# EAGLE design ESP32-S3 Parallel TFT with Touch 4.0“ ST7701 v1.2 (EAGLE 6.1)
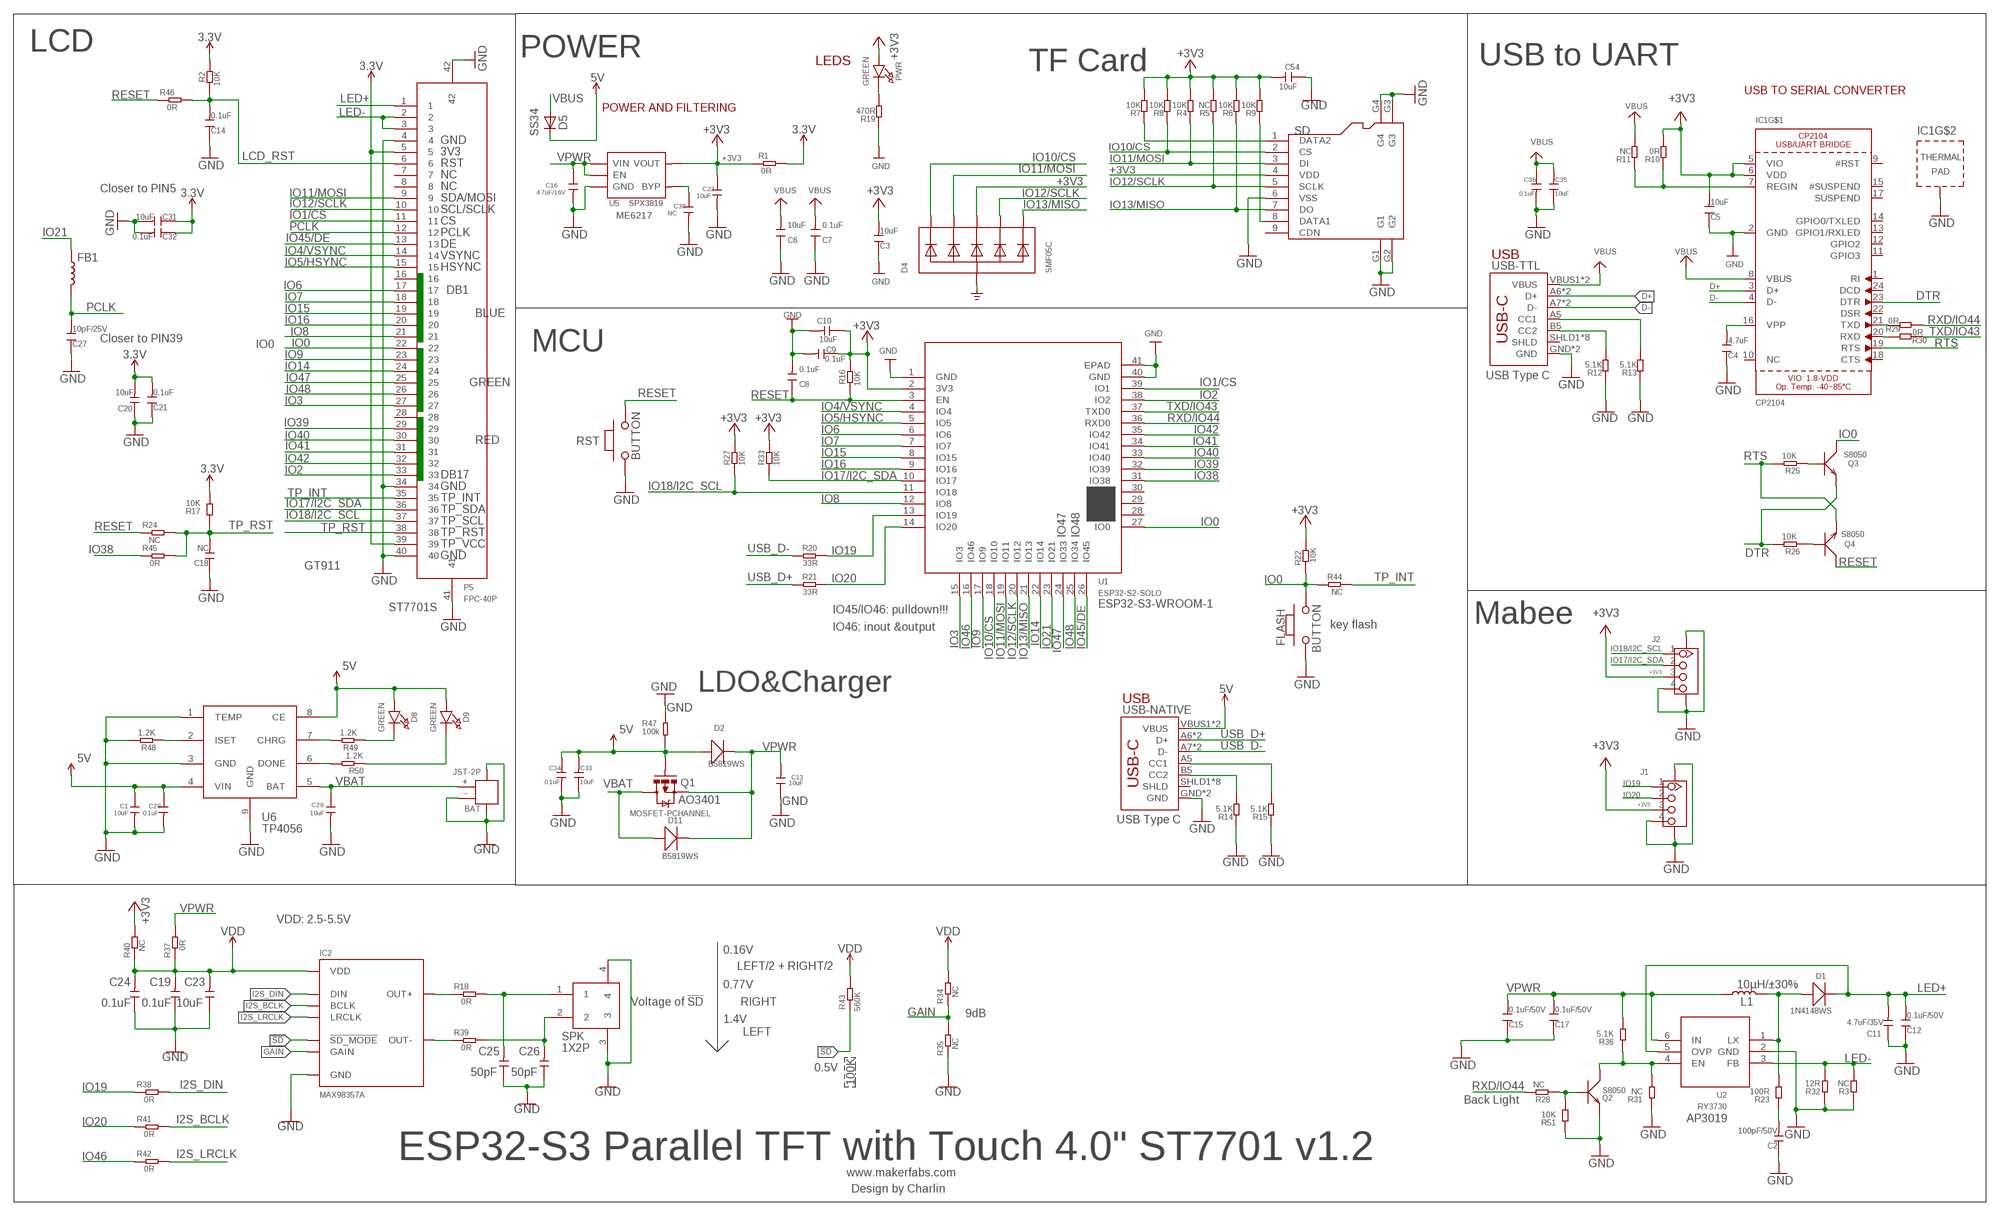
[diagram p0: schematic, sheet 1]

## Parts
BAT  JST-2P  JST-2P-SMD'2.0'  [HW2-SMD-2.0-90D]
C1  10uF  C-0603  [0603]
C2  100pF/50V  DISCRETE_C-0603  [DISCRETE_C0603]
C3  10uF  DISCRETE_C-0603  [DISCRETE_C0603]
C4  4.7uF  DISCRETE_C-0603  [DISCRETE_C0603]
C5  10uF  DISCRETE_C-0603  [DISCRETE_C0603]
C6  10uF  DISCRETE_C-0603  [DISCRETE_C0603]
C7  0.1uF  DISCRETE_C-0603  [DISCRETE_C0603]
C8  0.1uF  DISCRETE_C-0603  [DISCRETE_C0603]
C9  0.1uF  DISCRETE_C-0603  [DISCRETE_C0603]
C10  10uF  DISCRETE_C-0603  [DISCRETE_C0603]
C11  4.7uF/35V  DISCRETE_C-1206  [DISCRETE_C1206]
C12  0.1uF/50V  DISCRETE_C-0603  [DISCRETE_C0603]
C13  10uF  C-0603  [0603]
C14  0.1uF  DISCRETE_C-0603  [DISCRETE_C0603]
C15  0.1uF/50V  DISCRETE_C-0603  [DISCRETE_C0603]
C16  4.7uF/16V  C-0603  [0603]
C17  0.1uF/50V  DISCRETE_C-0603  [DISCRETE_C0603]
C18  NC  DISCRETE_C-0603  [DISCRETE_C0603]
C19  0.1uF  C-0603  [0603]
C20  10uF  DISCRETE_C-0603  [DISCRETE_C0603]
C21  0.1uF  DISCRETE_C-0603  [DISCRETE_C0603]
C22  10uF  C-0603  [0603]
C23  10uF  C-0603  [0603]
C24  0.1uF  C-0603  [0603]
C25  50pF  C-0603  [0603]
C26  50pF  C-0603  [0603]
C27  10pF/25V  DISCRETE_C-0603  [DISCRETE_C0603]
C28  0.1uF  C-0603  [0603]
C29  10uF  C-0603  [0603]
C30  NC  C-0603  [0603]
C31  10uF  DISCRETE_C-0603  [DISCRETE_C0603]
C32  0.1uF  DISCRETE_C-0603  [DISCRETE_C0603]
C33  10uF  C-0603  [0603]
C34  0.1uF  C-0603  [0603]
C35  10uF  C-0603  [0603]
C36  0.1uF  C-0603  [0603]
C54  10uF  DISCRETE_C-0603  [DISCRETE_C0603]
D1  1N4148WS  D'0805'  [SOD323]
D2  B5819WS  D'0805'  [SOD323]
D4  SMF05C  TVSARRAY_5LANE  [SOT363]
D5  SS34  DIODE-DO-214AC  [DO-214AC]
D8  GREEN  LED0805_NOOUTLINE  [CHIPLED_0805_NOOUTLINE]
D9  GREEN  LED0805_NOOUTLINE  [CHIPLED_0805_NOOUTLINE]
D11  B5819WS  D'0805'  [SOD323]
FB1  INDUCTORFB-30OHM  [0603]
FLASH  BUTTON  PB157  [157SW]
IC1  CP2104  [QFN24_4MM_SMSC]
IC2  MAX98357A  [TQFN-16]
J1  GROVE-CONNECTOR-SMD'90D'  [HW4-SMD-2.0-90D]
J2  GROVE-CONNECTOR-SMD'90D'  [HW4-SMD-2.0-90D]
L1  10µH/±30%  INDUCTOR-CR54-3.3UH  [CR54]
P5  FPC-40P  [SMD42-50P-2560L490W]
PWR  GREEN  LED0805_NOOUTLINE  [CHIPLED_0805_NOOUTLINE]
Q1  MOSFET-PCHANNEL  [SOT23-3]
Q2  S8050  TRANSISTOR-NPN-SOT23  [SOT23]
Q3  S8050  TRANSISTOR-NPN-SOT23  [SOT23]
Q4  S8050  TRANSISTOR-NPN-SOT23  [SOT23]
R1  0R  R-0603  [R0603]
R2  10K  R-0603  [R0603]
R3  NC  DISCRETE_R-0603  [DISCRETE_R0603]
R4  10K  DISCRETE_R-0603  [DISCRETE_R0603]
R5  NC  DISCRETE_R-0603  [DISCRETE_R0603]
R6  10K  DISCRETE_R-0603  [DISCRETE_R0603]
R7  10K  DISCRETE_R-0603  [DISCRETE_R0603]
R8  10K  DISCRETE_R-0603  [DISCRETE_R0603]
R9  10K  DISCRETE_R-0603  [DISCRETE_R0603]
R10  0R  DISCRETE_R-0603  [DISCRETE_R0603]
R11  NC  DISCRETE_R-0603  [DISCRETE_R0603]
R12  5.1K  DISCRETE_R-0603  [DISCRETE_R0603]
R13  5.1K  DISCRETE_R-0603  [DISCRETE_R0603]
R14  5.1K  DISCRETE_R-0603  [DISCRETE_R0603]
R15  5.1K  DISCRETE_R-0603  [DISCRETE_R0603]
R16  10K  R-0603  [R0603]
R17  10K  DISCRETE_R-0603  [DISCRETE_R0603]
R18  0R  R-0603  [R0603]
R19  470R  DISCRETE_R-0603  [DISCRETE_R0603]
R20  33R  R-0603  [R0603]
R21  33R  R-0603  [R0603]
R22  10K  R-0603  [R0603]
R23  100R  DISCRETE_R-0603  [DISCRETE_R0603]
R24  NC  R-0603  [R0603]
R25  10K  R-0603  [R0603]
R26  10K  R-0603  [R0603]
R27  10K  R-0603  [R0603]
R28  NC  DISCRETE_R-0603  [DISCRETE_R0603]
R29  0R  R-0603  [R0603]
R30  0R  R-0603  [R0603]
R31  NC  DISCRETE_R-0603  [DISCRETE_R0603]
R32  12R  DISCRETE_R-0603  [DISCRETE_R0603]
R33  10K  R-0603  [R0603]
R34  NC  R-0603  [R0603]
R35  NC  R-0603  [R0603]
R36  5.1K  DISCRETE_R-0603  [DISCRETE_R0603]
R37  0R  R-0603  [R0603]
R38  0R  R-0603  [R0603]
R39  0R  R-0603  [R0603]
R40  NC  R-0603  [R0603]
R41  0R  R-0603  [R0603]
R42  0R  R-0603  [R0603]
R43  560K  R-0603  [R0603]
R44  NC  R-0603  [R0603]
R45  0R  R-0603  [R0603]
R46  0R  R-0603  [R0603]
R47  100k  R-0603  [R0603]
R48  1.2K  R-0603  [R0603]
R49  1.2K  R-0603  [R0603]
R50  1.2K  R-0603  [R0603]
R51  10K  DISCRETE_R-0603  [DISCRETE_R0603]
RST  BUTTON  PB157  [157SW]
SD  HOLDER-MICROSD-9P  [9P-SMD-W/-RING]
SPK  1X2P  [1X2P-SMT1.25MM]
U1  ESP32­S2­SOLO  [ESP32-­S2-­SOLO]
U2  RY3730  [SOT23-6]
U5  SPX3819  [SOT23-5]
U6  TP4056  [SOP8-1.27P]
USB-NATIVE  USB_C5  [USB-C-16P-5]
USB-TTL  USB_C5  [USB-C-16P-5]

## Nets
3.3V: C20.2 C21.2 C31.1 C32.1 P5.5 P5.39 R1.2 R2.2 R17.2
5V: C1.1 C28.1 C33.2 C34.1 D2.+ D5.C D8.A D9.A Q1.1(G) R47.1 U6.4(VIN) U6.8(CE) USB-NATIVE.VBUS1(VBUS) USB-NATIVE.VBUS2(VBUS)
!SD: IC2.P$4(!SD_MODE) R43.1
+3V3: C3.2 C5.2 C9.1 C10.1 C22.1 C54.2 D4.4(C3) IC1.5(VIO) IC1.6(VDD) J1.3 J2.3 PWR.A R1.1 R4.2 R5.2 R6.2 R7.2 R8.2 R9.2 R10.2 R16.2 R22.2 R27.2 R33.2 R40.2 SD.4(VDD) U1.2(3V3) U5.5(VOUT)
D+: IC1.3(D+) USB-TTL.A6(D+) USB-TTL.B6(D+)
D-: IC1.4(D-) USB-TTL.A7(D-) USB-TTL.B7(D-)
DTR: IC1.23(DTR) Q3.2(E) R26.2
GAIN: IC2.P$2(GAIN) R34.1 R35.2
GND: BAT.3 BAT.4 BAT.- C1.2 C2.1 C3.1 C4.1 C5.1 C6.1 C7.1 C8.2 C9.2 C10.2 C11.1 C12.1 C13.1 C14.1 C15.1 C16.2 C17.1 C18.1 C19.1 C20.1 C21.1 C22.2 C23.1 C24.1 C25.1 C26.1 C27.1 C28.2 C29.2 C30.2 C31.2 C32.2 C33.1 C34.2 C35.1 C36.2 C54.1 D4.2(A) FLASH.1 IC1.2(GND) IC1.THERM(TP) IC2.P$3(GND) IC2.P$11(GND) IC2.P$15(GND) IC2.P$EP(GND) J1.4 J1.SS1 J1.SS2 J2.4 J2.SS1 J2.SS2 P5.4 P5.34 P5.40 P5.41 P5.42 Q2.2(E) R3.1 R12.1 R13.1 R14.1 R15.1 R19.1 R31.1 R32.1 R35.1 R47.2 R48.2 R51.1 RST.1 SD.6(VSS) SD.G1 SD.G2 SD.G3 SD.G4 SPK.3 SPK.4 U1.1(GND) U1.40(GND) U1.41(EPAD) U2.2(GND) U5.2(GND) U6.1(TEMP) U6.3(GND) U6.9(GND) USB-NATIVE.GND USB-NATIVE.GND2(GND) USB-TTL.GND USB-TTL.GND2(GND)
I2S_BCLK: IC2.P$16(BCLK) R41.2
I2S_DIN: IC2.P$1(DIN) R38.2
I2S_LRCLK: IC2.P$14(LRCLK) R42.2
IO0: FLASH.2 P5.22 Q3.3(C) R22.1 R44.1 U1.27(IO0)
IO1/CS: P5.11 U1.39(IO1)
IO2: P5.33 U1.38(IO2)
IO3: P5.27 U1.15(IO3)
IO4/VSYNC: P5.14 U1.4(IO4)
IO5/HSYNC: P5.15 U1.5(IO5)
IO6: P5.17 U1.6(IO6)
IO7: P5.18 U1.7(IO7)
IO8: P5.21 U1.12(IO8)
IO9: P5.23 U1.17(IO9)
IO10/CS: D4.1(C1) R8.1 SD.2(CS) U1.18(IO10)
IO11/MOSI: D4.3(C2) P5.9 R4.1 SD.3(DI) U1.19(IO11)
IO12/SCLK: D4.5(C4) P5.10 R5.1 SD.5(SCLK) U1.20(IO12)
IO13/MISO: D4.6(C5) R6.1 SD.7(DO) U1.21(IO13)
IO14: P5.24 U1.22(IO14)
IO15: P5.19 U1.8(IO15)
IO16: P5.20 U1.9(IO16)
IO17/I2C_SDA: J2.2 P5.36 R33.1 U1.10(IO17)
IO18/I2C_SCL: J2.1 P5.37 R27.1 U1.11(IO18)
IO19: J1.1 R20.2 R38.1 U1.13(IO19)
IO20: J1.2 R21.2 R41.1 U1.14(IO20)
IO21: FB1.1 U1.23(IO21)
IO38: R45.1 U1.31(IO38)
IO39: P5.29 U1.32(IO39)
IO40: P5.30 U1.33(IO40)
IO41: P5.31 U1.34(IO41)
IO42: P5.32 U1.35(IO42)
IO45/DE: P5.13 U1.26(IO45)
IO46: R42.1 U1.16(IO46)
IO47: P5.25 U1.24(IO33)
IO48: P5.26 U1.25(IO34)
LCD_RST: C14.2 P5.6 R2.1 R46.2
LED+: C11.2 C12.2 D1.- P5.1 U2.5(OVP)
LED-: P5.2 P5.3 R3.2 R32.2 U2.3(FB)
N$1: C4.2 IC1.16(VPP)
N$2: Q4.1(B) R26.1
N$3: Q3.1(B) R25.1
N$4: IC2.P$9(OUT+) R18.1
N$6: R15.2 USB-NATIVE.A5(CC1)
N$7: PWR.C R19.2
N$8: Q2.1(B) R28.1 R51.2
N$10: R13.2 USB-TTL.A5(CC1)
N$11: R12.2 USB-TTL.B5(CC2)
N$12: IC1.7(REGIN) R10.1 R11.1
N$13: IC2.P$10(OUT-) R39.1
N$14: R14.2 USB-NATIVE.B5(CC2)
N$15: C25.2 R18.2 SPK.1
N$16: C26.2 R39.2 SPK.2
N$17: D1.+ L1.P$2 R23.2 U2.1(LX)
N$18: IC1.21(TXD) R29.2
N$19: IC1.20(RXD) R30.2
N$22: C2.2 R23.1
N$23: R48.1 U6.2(ISET)
N$24: Q2.3(C) R31.2 R36.1 U2.4(EN)
N$29: R49.2 U6.7(CHRG)
N$30: R50.2 U6.6(DONE)
N$31: D8.C R49.1
N$32: D9.C R50.1
N$47: R7.1 SD.1(DATA2)
N$48: R9.1 SD.8(DATA1)
N$76: C30.1 U5.4(BYP)
PCLK: C27.2 FB1.2 P5.12
RESET: C8.1 Q4.3(C) R16.1 R24.1 R46.1 RST.2 U1.3(EN)
RTS: IC1.19(RTS) Q4.2(E) R25.2
RXD/IO44: R28.2 R29.1 U1.36(RXD0)
TP_INT: P5.35 R44.2
TP_RST: C18.2 P5.38 R17.1 R24.2 R45.2
TXD/IO43: R30.1 U1.37(TXD0)
USB_D+: R21.1 USB-NATIVE.A6(D+) USB-NATIVE.B6(D+)
USB_D-: R20.1 USB-NATIVE.A7(D-) USB-NATIVE.B7(D-)
VBAT: BAT.+ C29.1 D11.+ Q1.3(D) U6.5(BAT)
VBUS: C6.2 C7.2 C35.2 C36.1 D5.A IC1.8(VBUS) R11.2 USB-TTL.VBUS1(VBUS) USB-TTL.VBUS2(VBUS)
VDD: C19.2 C23.2 C24.2 IC2.P$7(VDD) IC2.P$8(VDD) R34.2 R37.1 R40.1 R43.2
VPWR: C13.2 C15.2 C16.1 C17.2 D2.- D11.- L1.P$1 Q1.2(S) R36.2 R37.2 U2.6(IN) U5.1(VIN) U5.3(EN)
Unconnected: IC1.1(RI) IC1.9(#RST) IC1.10(NC) IC1.11(GPIO3) IC1.12(GPIO2) IC1.13(GPIO1/RXLED) IC1.14(GPIO0/TXLED) IC1.15(#SUSPEND) IC1.17(SUSPEND) IC1.18(CTS) IC1.22(DSR) IC1.24(DCD) P5.7 P5.8 P5.16 P5.28 SD.9(CDN) U1.28(IO35) U1.29(IO36) U1.30(IO37) USB-NATIVE.SHLD1(SHLD) USB-NATIVE.SHLD2(SHLD) USB-NATIVE.SHLD3(SHLD) USB-NATIVE.SHLD4(SHLD) USB-NATIVE.SHLD5(SHLD) USB-NATIVE.SHLD6(SHLD) USB-NATIVE.SHLD7(SHLD) USB-NATIVE.SHLD8(SHLD) USB-TTL.SHLD1(SHLD) USB-TTL.SHLD2(SHLD) USB-TTL.SHLD3(SHLD) USB-TTL.SHLD4(SHLD) USB-TTL.SHLD5(SHLD) USB-TTL.SHLD6(SHLD) USB-TTL.SHLD7(SHLD) USB-TTL.SHLD8(SHLD)

## Notes on the sheet
- LCD | POWER
- LEDS | USB to UART
- TF Card
- USB TO SERIAL CONVERTER
- POWER AND FILTERING
- GND
- 3V3
- RST
- NC
- Closer to PIN5 | NC
- SDA/MOSI
- SCL/SCLK
- ME6217
- CS
- PCLK
- DE
- VSYNC | USB
- HSYNC
- DB1
- BLUE
- Closer to PIN39
- IO0
- MCU
- USB Type C
- GREEN
- RED
- DB17
- GND
- TP_INT
- TP_SDA
- TP_SCL
- TP_RST | IO47 | IO48
- TP_VCC
- GND
- GT911
- ESP32-S3-WROOM-1
- ST7701S | IO45/IO46: pulldown!!!
- Mabee
- IO46: inout &output | key flash
- LDO&Charger
- USB
- AO3401
- USB Type C
- VDD: 2.5-5.5V
- 0.16V
- LEFT/2 + RIGHT/2
- 0.77V
- Voltage of !SD | RIGHT
- 9dB
- 1.4V
- LEFT
- 0.5V
- 100K
- Back Light
- AP3019
- ESP32-S3 Parallel TFT with Touch 4.0" ST7701 v1.2
- www.makerfabs.com
- Design by Charlin

## Library data of the parts
BAT = Connector-new:JST-2P-SMD: 2P-SMD-1.0-90D:320110054;2P-SMD-2.0-90D:320110026
C1 C13 C16 C19 C22-C26 C28-C30 C33-C36 = Discrete:C*: Ceramic Capacitors
C2-C12 C14 C15 C17 C18 C20 C21 C27 C31 C32 C54 = A9G:DISCRETE_C*: Ceramic Capacitors
D1 D2 D11 = Discrete:D*
D4 = microbuilder:TVSARRAY_5LANE: Voltage Transient Suppressor Array SOT363 SMF05C - 100W 5V: Digikey - SMF05CT1GOSCT-ND
D5 = diode:DIODE-: DIODE
D8 D9 PWR = microbuilder:LED: LED 0603 - 0603 Surface Mount Package 2mA: Green LED - Low Power (3.9mcd, 2ma, 1.7Vf) - Digikey: 475-2709-2-ND Orange LED - Low Power (9.8mcd, 2ma, 1.8Vf) - Digikey: 475-1194-2-ND Red LED - Low Power (5mcd, 2ma, 1.8Vf) - Digikey: 475-1195-2-ND Yellow LED - Low Power (7mcd, 2ma, 1.8Vf) - Digikey: 475-1196-2-ND 5mA: Blue LED - Low Power (17mcd, 5ma, 2.9Vf) - Digikey: LNJ937W8CRACT-ND 0805 - 0805 Surface Mount Package 2mA: Red LED (8.8mcd, 2mA, 1.8Vf, Clear) - Low Power [Digikey: 475-2510-1-ND] Green LED (5mcd, 2mA, 1.8Vf, Clear) - Low Power [Digikey: 475-2730-1-ND] Yellow LED (11.3mcd, 2mA, 1.8Vf, Clear) - Low Power [Digikey: 475-2555-1-ND] 20mA: Red LED (104mcd, 20mA, Diffused) - LS R976 [Digikey: 475-1278-6-ND] Red LED (12mcd, 20mA, 2.0Vf, Clear) - APT2012EC [Digikey: 754-1128-1-ND] Green LED (15mcd, 20mA, 2.2Vf, Clear) - APT2012GC [Digikey: 754-1131-1-ND] Orange LED (160mcd, 20mA, 2.1Vf, Clear) - APT2012SECK [Digikey: 754-1130-1-ND] 1206 - 1206 Surface Mount Package Green LED (26mcd, 20mA, Diffused) - LG N971 [Digikey: 475-1407-6-ND] Red LED (15mcd, 20mA, Diffused) - LH N974 [Digikey: 475-1416-6-ND] Cree - Cree High-Power Surface Mount LEDs XPEBWT-L1-0000-00D50 - White 111lm 350mA 2.9Vf 6200K 110° XTEAWT-00-0000-00000LEE3 - White 114lm 350mA 2.85Vf 5000K 115° Everlight - Everlight 45-21 Series Surface Mount LEDs 45-21/QK2C-B2832AC2CB2/2T - Warm White 2000mcd 20mA 3.25Vf 3050K 120° 45-21/LK2C-B38452C4CB2/2T - Nuetral White 2000mcd 20mA 3.25Vf 4150K 120° 45-21/LK2C-B50634C6CB2/2T - Cold White 2200mcd 20mA 3.25Vf 5650K 120° PLCC2 Reverse Mount LS T77K-J1L2-1-0-2-R18-Z - Red 11.25mcd 2mA 1.8Vf 630nm 120° LO T77K-L1M2-24-Z - Orange 19.6mcd 2mA 1.8Vf 606nm 120° LY T77K-K2M1-26-Z - Yellow 15.7mcd 2mA 1.8Vf 587nm 120°
FB1 = SparkFun-Coils:INDUCTOR: Inductors Resist changes in electrical current. Basically a coil of wire. SparkFun Products: SparkFun Load Cell Amplifier - HX711 <https://www.sparkfun.com/products/13879> IOIO-OTG - V2.2 <https://www.sparkfun.com/products/13613>; PROD_ID: NDUC-07859
FLASH RST = MySMD:PB157
IC1 = microbuilder:CP2104: CP2104 - USB to UART Bridge VDD Output: 3.45V
IC2 = SparkFun-IC-Amplifiers:MAX98357A: I2S DAC 3.2W (4-8ohm); PROD_ID: IC-14032
J1 J2 = Connector-new:GROVE-CONNECTOR-SMD: 4P-SMD-2.0:320110030;4P-SMD-2.0-90D:320110032
L1 = SparkFun-Coils:INDUCTOR: Inductors Resist changes in electrical current. Basically a coil of wire. SparkFun Products: SparkFun Load Cell Amplifier - HX711 <https://www.sparkfun.com/products/13879> IOIO-OTG - V2.2 <https://www.sparkfun.com/products/13613>; PROD_ID: NDUC-11157; VALUE: 3.3µH/±30%/3.4A
P5 = self:FPC-40P
Q1 = User-Submitted:MOSFET-PCHANNEL: Generic PMOSFET IRLML2244 - TRANS-11153 (SOT-23 -20V -4.3A) (1.Gate 2.Source 3.Drain) FQP27P06 - COM-10349 <http://www.sparkfun.com/products/10349> (TO-220 -60V -27A) (1.Gate 2.Source 3.Drain); PROD_ID: TRANS-08285
Q2-Q4 = Discrete:TRANSISTOR-NPN*: NPN audion
R1 R2 R16 R18 R20-R22 R24-R27 R29 R30 R33-R35 R37-R50 = Discrete:R*
R3-R15 R17 R19 R23 R28 R31 R32 R36 R51 = A9G:DISCRETE_R*
SD = Connector:HOLDER-MICROSD-9P
SPK = sale:1X2P
U1 = self:ESP32­S2­SOLO
U2 = sale:RY3730
U5 = IC:SPX3819
U6 = self:TP4056
USB-NATIVE USB-TTL = USBC:USB_C: USB Type C 16Pin Connector Super Speed pins not available on the 16-pin purely SMD connector so this part is best for USB 2.0 implementations. D1 and D2 are tied together enabling D+/- no matter which way the cable is plugged into the connector. The two channel configuration pins (CC1/2) are exposed. These are normally connected to ground via 5.1k resistors but can be reconfigured for high current/high power applications.

## Net classes
0 default: width 0.152 mm, drill 0.305 mm, clearance 0.152 mm
1 vbat: width 0.254 mm, drill 0.305 mm, clearance 0.203 mm

## Board
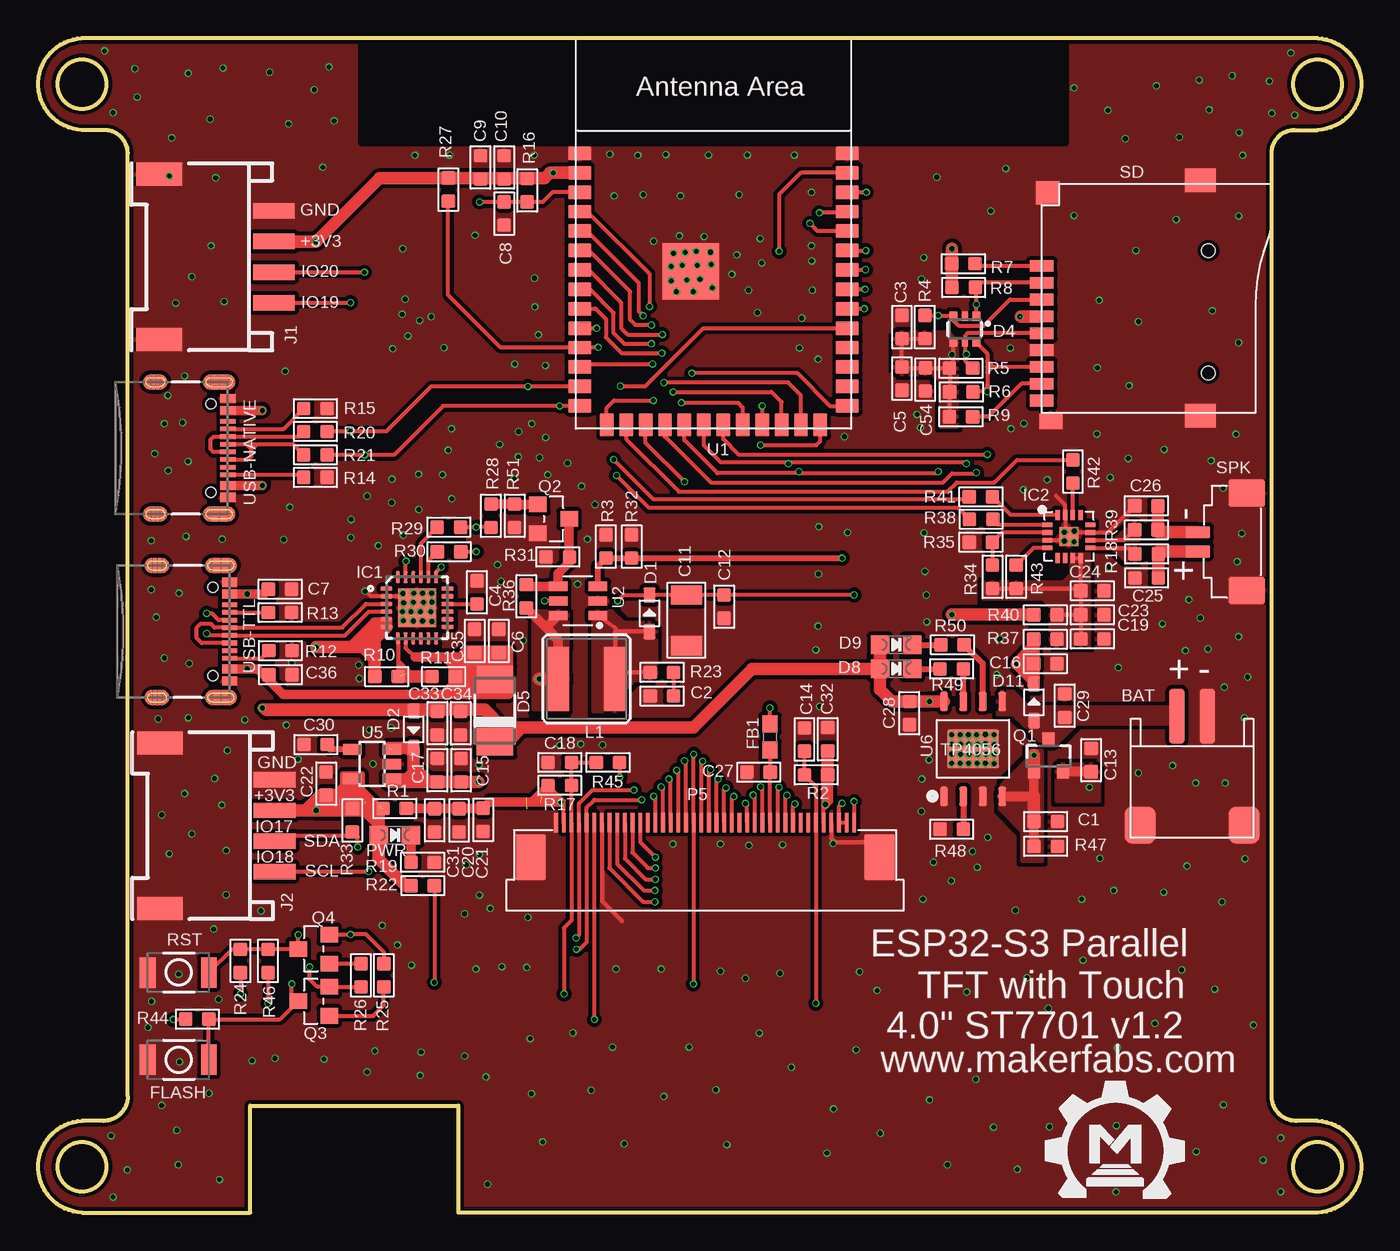
[diagram p1: board, top side]
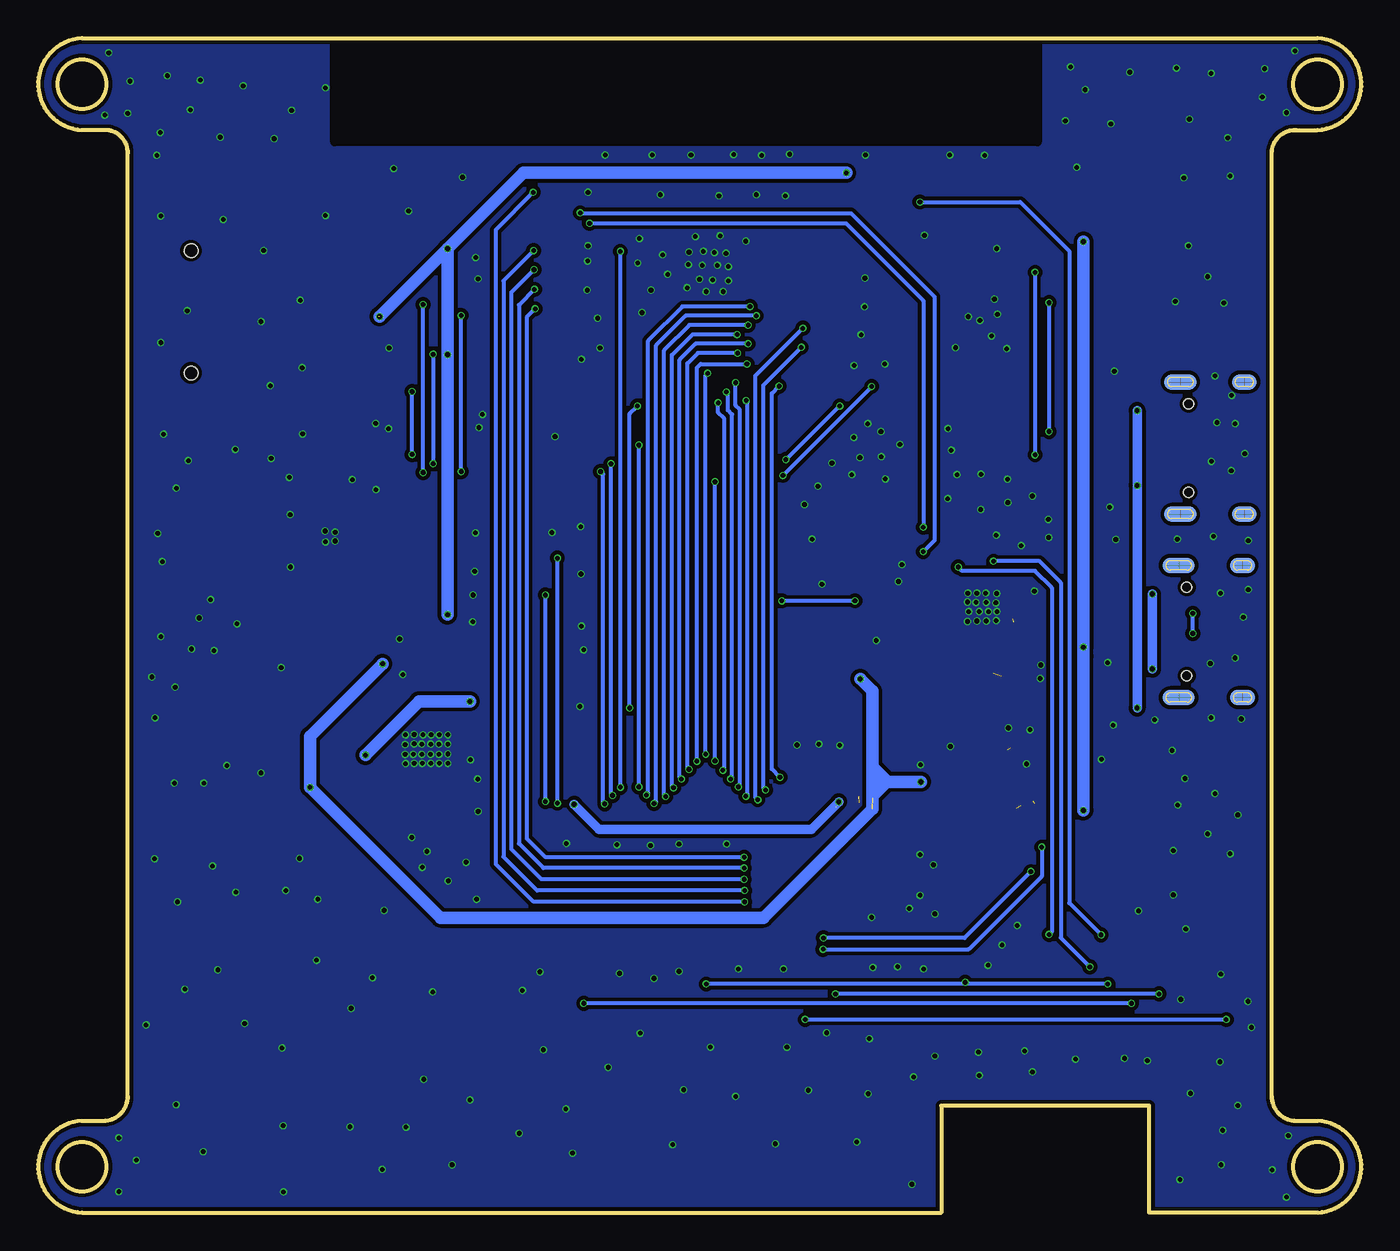
[diagram p2: board, bottom side, seen from below]

Size 86.52 x 76.8 mm. Coordinates in mm from the lower left corner, seen from the top.
Outline: 83.66,76.8 2.86,76.8 arc175 2.86,70.8 4.26,70.8 arc-90 5.86,69.3 5.86,7.6 arc-90 4.26,6 2.86,6 arc175 2.86,0 13.86,0 13.86,7 27.46,7 27.46,0 83.66,0 arc175 83.66,6 82.26,6 arc-90 80.66,7.6 80.66,69.3 arc-90 82.16,70.8 83.66,70.8 arc175 83.66,76.8
Outline: circle at 2.86,3 radius 1.6
Outline: circle at 2.86,73.8 radius 1.6
Outline: circle at 83.66,73.8 radius 1.6
Outline: circle at 83.66,3 radius 1.6
Copper layers (1*16): Top 0.035mm / dielectric 1.5mm / Bottom 0.035mm
Design rules: minimum track width 6mil, minimum drill 10mil, track to track 6mil, track to pad 6mil, pad to pad 6mil, via to via 6mil, smd to smd 0mil, copper to edge 10mil, drill to drill 10mil, minimum pad ring 3mil, minimum via ring 3mil, stop-mask expansion 2mil, vias tented up to drill 100mil, thermal gap 0mil
tRestrict: area 21.2,70 to 67.2,76.8
bRestrict: area 21.2,70 to 67.2,76.8

### Footprints (pad centres in the part's own frame; a part is rotated, then mirrored left to right if it is on the bottom)
HW2-SMD-2.0-90D = smd 2 x 2.4: 3 3.4,-2.181; 4 -3.4,-2.181 | smd 1 x 3.6: + -1,4.953; - 1,4.953
0603 = smd 0.889 x 0.889: 1 -0.762,0; 2 0.762,0
DISCRETE_C0603 = smd 0.889 x 0.889: 1 -0.762,0; 2 0.762,0
DISCRETE_C1206 = smd 1.27 x 2.032: 1 -1.651,0; 2 1.651,0
SOD323 = smd 1 x 0.8: + -1.2,0; - 1.2,0
SOT363 = smd 0.5 x 0.5: 1 -0.75,-0.9; 3 0.75,-0.9; 4 0.75,0.9; 6 -0.75,0.9 | smd 0.4 x 0.5: 2 0,-0.9; 5 0,0.9
DO-214AC = smd 1.8 x 2.4: A 2.025,0; C -2.025,0
CHIPLED_0805_NOOUTLINE = smd 1.2 x 1.2: A 0,-1.05; C 0,1.05
0603' = smd 1.1 x 1: 1 -0.85,0; 2 0.85,0
157SW = smd 1.016 x 1.981: 1 0,0; 2 4,0
QFN24_4MM_SMSC = smd 0.8 x 0.28: 1 -2,1.25; 2 -2,0.75; 3 -2,0.25; 4 -2,-0.25; 5 -2,-0.75; 6 -2,-1.25; 13 2,-1.25; 14 2,-0.75; 15 2,-0.25; 16 2,0.25; 17 2,0.75; 18 2,1.25 | smd 0.28 x 0.8: 7 -1.25,-2; 8 -0.75,-2; 9 -0.25,-2; 10 0.25,-2; 11 0.75,-2; 12 1.25,-2; 19 1.25,2; 20 0.75,2; 21 0.25,2; 22 -0.25,2; 23 -0.75,2; 24 -1.25,2 | smd 2.5 x 2.5: THERM 0,0
TQFN-16 = smd 0.3 x 0.65: P$1 -0.75,-1.4; P$2 -0.25,-1.4; P$3 0.25,-1.4; P$4 0.75,-1.4; P$9 0.75,1.4; P$10 0.25,1.4; P$11 -0.25,1.4; P$12 -0.75,1.4 | smd 0.65 x 0.3: P$5 1.4,-0.75; P$6 1.4,-0.25; P$7 1.4,0.25; P$8 1.4,0.75; P$13 -1.4,0.75; P$14 -1.4,0.25; P$15 -1.4,-0.25; P$16 -1.4,-0.75 | smd 1.23 x 1.23: P$EP 0,0
HW4-SMD-2.0-90D = smd 1.01 x 2.74: 1 -3,-0.1; 2 -1,-0.1; 3 1,-0.1; 4 3,-0.1 | smd 1.5 x 3: SS1 -5.4,7.4; SS2 5.4,7.4
CR54 = smd 4.2 x 1.4: P$1 0,1.85; P$2 0,-1.85
SMD42-50P-2560L490W = smd 0.3 x 1.3: 1 9.75,0; 2 9.25,0; 3 8.75,0; 4 8.25,0; 5 7.75,0; 6 7.25,0; 7 6.75,0; 8 6.25,0; 9 5.75,0; 10 5.25,0; 11 4.75,0; 12 4.25,0; 13 3.75,0; 14 3.25,0; 15 2.75,0; 16 2.25,0; 17 1.75,0; 18 1.25,0; 19 0.75,0; 20 0.25,0; 21 -0.25,0; 22 -0.75,0; 23 -1.25,0; 24 -1.75,0; 25 -2.25,0; 26 -2.75,0; 27 -3.25,0; 28 -3.75,0; 29 -4.25,0; 30 -4.75,0; 31 -5.25,0; 32 -5.75,0; 33 -6.25,0; 34 -6.75,0; 35 -7.25,0; 36 -7.75,0; 37 -8.25,0; 38 -8.75,0; 39 -9.25,0; 40 -9.75,0 | smd 2 x 3: 41 -11.4,-2.25; 42 11.4,-2.25
SOT23-3 = smd 0.8 x 0.9: 1 -0.95,-1; 2 0.95,-1; 3 0,1.1
SOT23 = smd 1.016 x 1.143: 1 -0.95,-1.016; 2 0.95,-1.016; 3 0,1.016
R0603 = smd 0.889 x 0.889: 1 -0.762,0; 2 0.762,0
DISCRETE_R0603 = smd 0.889 x 0.889: 1 -0.762,0; 2 0.762,0
9P-SMD-W/-RING = smd 1.524 x 0.762: 1 0,4.4; 2 0,3.3; 3 0,2.2; 4 0,1.1; 5 0,0; 6 0,-1.1; 7 0,-2.2; 8 0,-3.3; 9 0,-4.4 | smd 1.524 x 1.016: G1 0.6,-5.746 | smd 2.032 x 1.524: G2 10.373,-5.4; G3 10.373,10 | smd 1.524 x 1.524: G4 0.392,9.181 | hole 0.889: 10.9,-2.6; 10.9,5.4
1X2P-SMT1.25MM = smd 0.8 x 1.6: 1 -0.625,0; 2 0.625,0 | smd 1.8 x 2.4: 3 3.175,-3.2; 4 -3.175,-3.2
ESP32-­S2-­SOLO = smd 1.5 x 0.9: 1 -8.75,5.26; 2 -8.75,3.99; 3 -8.75,2.72; 4 -8.75,1.45; 5 -8.75,0.18; 6 -8.75,-1.09; 7 -8.75,-2.36; 8 -8.75,-3.63; 9 -8.75,-4.9; 10 -8.75,-6.17; 11 -8.75,-7.44; 12 -8.75,-8.71; 13 -8.75,-9.98; 14 -8.75,-11.25; 27 8.75,-11.25; 28 8.75,-9.98; 29 8.75,-8.71; 30 8.75,-7.44; 31 8.75,-6.17; 32 8.75,-4.9; 33 8.75,-3.63; 34 8.75,-2.36; 35 8.75,-1.09; 36 8.75,0.18; 37 8.75,1.45; 38 8.75,2.72; 39 8.75,3.99; 40 8.75,5.26 | smd 0.9 x 1.5: 15 -6.985,-12.5; 16 -5.715,-12.5; 17 -4.445,-12.5; 18 -3.175,-12.5; 19 -1.905,-12.5; 20 -0.635,-12.5; 21 0.635,-12.5; 22 1.905,-12.5; 23 3.175,-12.5; 24 4.445,-12.5; 25 5.715,-12.5; 26 6.985,-12.5 | smd 3.7 x 3.7: 41 -1.5,-2.46
SOT23-6 = smd 1.2 x 0.6: 1 -1.3,0.95; 2 -1.3,0; 3 -1.3,-0.95; 4 1.3,-0.95; 5 1.3,0; 6 1.3,0.95
SOT23-5 = smd 0.69 x 1.2: 1 -0.95,-1.3; 2 0,-1.3; 3 0.95,-1.3; 4 0.95,1.3; 5 -0.95,1.3
SOP8-1.27P = smd 1.27 x 0.51: 1 -3.1,1.905; 2 -3.1,0.635; 3 -3.1,-0.635; 4 -3.1,-1.905; 5 3.1,-1.905; 6 3.1,-0.635; 7 3.1,0.635; 8 3.1,1.905 | smd 2.5 x 3.4: 9 0,0
USB-C-16P-5 = smd 0.3 x 1: A5 -1.25,-0.34; A6 -0.25,-0.34; A7 0.25,-0.34; A8 1.25,-0.34; B5 1.75,-0.34; B6 0.75,-0.34; B7 -0.75,-0.34; B8 -1.75,-0.34 | smd 0.6 x 1: GND -3.225,-0.34; GND2 3.225,-0.34; VBUS1 -2.45,-0.34; VBUS2 2.45,-0.34 | smd 1 x 2.1: SHLD1 -4.32,-0.915; SHLD2 4.32,-0.915 | smd 1 x 2.1 bottom: SHLD3 -4.32,-0.915; SHLD4 4.32,-0.915 | smd 1 x 1.6: SHLD5 -4.32,-5.095; SHLD8 4.32,-5.095 | smd 1 x 1.6 bottom: SHLD6 -4.32,-5.095; SHLD7 4.32,-5.095 | hole 0.65: -2.89,-1.445; 2.89,-1.445

### Placement (x,y rotation side)
BAT  75.46,27.51 0 top
C1  65.88,25.58 0 top
C2  40.78,33.78 0 top
C3  56.48,57.91 270 top
C4  28.69,40.56 270 top
C5  56.48,54.53 90 top
C6  30.12,37.39 270 top
C7  15.82,40.77 180 top
C8  30.47,65.33 270 top
C9  28.92,68.35 90 top
C10  30.47,68.35 90 top
C11  42.38,38.73 90 top
C12  44.85,39.62 90 top
C13  68.85,29.59 270 top
C14  50.11,30.94 270 top
C15  27.65,28.93 270 top
C16  65.86,35.89 0 top
C17  26.1,28.93 270 top
C18  34.1,29.44 0 top
C19  68.93,37.52 180 top
C20  27.52,25.65 90 top
C21  29.1,25.68 90 top
C22  18.83,28.06 90 top
C23  68.93,39.09 180 top
C24  68.93,40.67 180 top
C25  72.48,41.5 0 top
C26  72.46,46.23 0 top
C27  47.11,28.8 0 top
C28  56.96,32.66 270 top
C29  67.12,33.15 90 top
C30  18.15,30.61 180 top
C31  25.92,25.66 270 top
C32  51.63,30.96 90 top
C33  26.1,32 90 top
C34  27.63,32 270 top
C35  28.54,37.39 270 top
C36  15.84,35.18 0 top
C54  58.01,54.48 90 top
D1  39.97,39.19 90 top
D2  24.55,31.6 270 top
D4  60.6,57.78 180 top
D5  29.86,32.82 90 top
D8  56.1,35.56 270 top
D9  56.1,37.13 270 top
D11  65.12,33.38 90 top
FB1  [0603']  47.85,31.1 270 top
FLASH  7.16,10 0 top
IC1  24.77,39.55 0 top
IC2  67.4,44.22 270 top
J1  15.31,62.5 90 top
J2  15.36,25.3 90 top
L1  35.86,34.9 90 top
P5  43.61,25.5 0 top
PWR  23.32,24.69 270 top
Q1  66.06,29.84 0 top
Q2  33.7,45.36 270 top
Q3  18.01,13.82 90 top
Q4  18.02,17.24 90 top
R1  23.31,26.42 0 top
R2  50.87,28.63 0 top
R3  37.13,43.56 270 top
R4  57.98,57.91 270 top
R5  60.34,55.22 180 top
R6  60.37,53.67 180 top
R7  60.49,62.05 180 top
R8  60.52,60.5 180 top
R9  60.34,52.04 180 top
R10  22.78,35.05 180 top
R11  26.51,35.05 0 top
R12  15.84,36.75 180 top
R13  15.82,39.24 180 top
R14  18.13,48.08 180 top
R15  18.13,52.58 180 top
R16  31.97,66.85 90 top
R17  34.1,27.94 180 top
R18  72.48,43.08 0 top
R19  25.14,22.91 180 top
R20  18.13,51.08 0 top
R21  18.13,49.56 0 top
R22  25.14,21.38 180 top
R23  40.78,35.33 180 top
R24  13.23,16.46 270 top
R25  22.6,15.52 90 top
R26  21.11,15.52 270 top
R27  26.81,66.9 90 top
R28  29.61,45.57 270 top
R29  26.85,44.82 180 top
R30  26.87,43.22 180 top
R31  33.98,42.88 0 top
R32  38.8,43.56 270 top
R33  20.54,25.65 90 top
R34  62.4,41.58 270 top
R35  61.64,43.84 0 top
R36  31.92,40.31 270 top
R37  65.85,37.49 180 top
R38  61.66,45.34 0 top
R39  72.46,44.65 0 top
R40  65.85,39.09 180 top
R41  61.64,46.81 0 top
R42  67.66,48.46 270 top
R43  63.95,41.58 270 top
R44  10.41,12.65 180 top
R45  37.25,29.44 180 top
R46  15.03,16.46 270 top
R47  65.88,23.95 0 top
R48  59.73,25.07 180 top
R49  59.73,35.56 0 top
R50  59.78,37.13 0 top
R51  31.16,45.57 90 top
RST  7.16,15.7 0 top
SD  65.63,57.5 0 top
SPK  75.84,43.87 90 top
U1  44.16,64.01 0 top
U2  35.3,40.01 180 top
U5  21.84,29.34 90 top
U6  61.13,30.33 90 top
U$1  [MAKERFABS_0.3]  66.32,0.97 0 top
USB-NATIVE  12.75,50 270 top
USB-TTL  12.86,38 270 top

### Tracks (layer width: path | path; a pad name or v marks a point on that pad's centre or on a via)
3.3V  (via drill 0.3)  (2 unrouted)
  Top 0.254: P5.5 51.36,28.36 R2.2 | 51.38,26.39 51.58,26.59 | 51.58,26.59 51.86,26.87 51.86,28.25 51.71,28.25 51.71,26.9 | v51.48,26.7 51.58,26.59 | P5.39 34.36,26.92 R17.2 33.34,27.58 34.36,26.57 34.36,26.77 33.27,27.86 33.04,27.86 | R1.2 C31.1 C20.2 29.07,26.41 C21.2 | 32.83,26.82 32.96,26.7 34.18,26.7 34.36,26.52 34.36,26.64 34.13,26.87 33.29,26.87
  Top 0.406: v51.48,26.7 51.48,30.05 C32.1
  Top 0.61: v34.17,26.86 32.3,26.86 | 32.3,26.86 29.52,26.86 C21.2 | R1.2 29.06,26.42 29.1,26.47 | R17.2 33.34,27.9 32.3,26.86 | 32.89,27.23 33.77,27.23
  Top 0.813: R2.2 C32.1
  Bottom 0.61: v51.48,26.7 49.85,25.07 35.96,25.07 v34.17,26.86
5V  (via drill 0.3)
  Top 0.61: USB-NATIVE.VBUS1 v14.66,52.45 | USB-NATIVE.VBUS2 v14.66,47.55 | Q1.1 65.11,27.23 | C1.1 R47.1 | U6.4 65.11,27.23 | C28.1 | 27.39,33 v14.66,33 14.89,32.77 C33.2 | 27.39,33 C34.1 | 27.39,33 29.22,33 29.79,32.44 29.79,32.21 | 29.79,32.21 29.79,30.86 D5.C | D2.+ 29.2,32.8 29.79,32.21
  Top 0.813: U6.8 v58.29,33.43 v58.28,33.43 C28.1 | v65.12,29.92 65.12,28.86 Q1.1 | 31.62,31.73 30.35,31.73 29.18,32.89 | 31.62,31.73 42.84,31.73 46.68,35.56 D8.A | D5.C 30.68,30.79 31.62,31.73 | D9.A D8.A | D8.A 55.05,34.2 55.82,33.43 C28.1 | C1.1 65.12,27.22 65.11,27.23
  Bottom 0.61: v14.66,52.45 v14.66,47.55 v14.66,33
  Bottom 0.813: v58.29,33.43 61.61,33.43 v65.12,29.92
  pour Top: 64.69,30.18 64.69,29.64 62.81,27.76 62.81,26.47 64.33,24.94 64.33,23 65.65,23 65.65,30.18
!SD
  Top 0.254: IC2.P$4 65.08,43.47 R43.1
+3V3  (via drill 0.3)  (5 unrouted)
  Top 0.254: R5.2 59.85,55.49 D4.4 | R5.2 59.61,55.19 R6.2 59.58,53.65 R9.2 | R5.2 58.04,55.22 C54.2 56.54,55.24 C5.2 C3.2 R4.2 | v33.67,68 | R27.2 28.85,67.67 C9.1 C10.1 31.95,67.59 R16.2 32.61,67.61 32.63,67.64 | 22.04,26.3 20.57,26.3 20.54,26.32 R33.2 | 22.04,26.3 22.43,26.3 | 22.27,26.07 22.04,26.3 | IC1.5 IC1.6 | 22.5,38.81 22.5,38.33 22.93,38.33 | 22.93,38.33 23.03,38.33 23.03,38.81 | R10.2 21.99,35.08 21.99,37.39 22.93,38.33
  Top 0.406: 17.01,26.47 17.37,26.47 18.43,27.53 19.52,27.53 19.93,27.94 19.93,28.68 21.15,28.68 21.15,27.71 22.27,26.59 21.84,26.59 20.92,27.51 20.92,28.02 20.13,28.02 19.32,27.2 18.46,27.2 17.92,26.67 18.23,26.67 18.46,26.9 21.25,26.9 | 21.43,26.9 21.25,26.9 | 21.25,26.9 21,27.15 19.68,27.15 | 19.47,27.15 19.68,27.15 | 19.68,27.15 20.24,27.71
  Top 0.61: 20.49,37.11 22.01,38.63 22.73,38.63 21.1,37.01
  Top 0.813: R8.2 59.76,62.03 R7.2 59.75,62.07 v59.75,63.04 | 64.26,58.6 SD.4 | U1.2 v33.67,68 33.47,68 33.11,67.64 32.63,67.64 22.32,67.64 v18.18,63.5 | v59.75,39.1 R40.2 | R10.2 22.01,36.22 | 22.01,36.22 22.01,37.55 IC1.6 21.45,36.98 21.25,36.98 | v18.17,36.98 21.25,36.98 | 21.25,36.98 22.01,36.22 | J2.3 v18.18,26.3 18.74,26.3 | 18.74,26.3 22.43,26.3 R1.1 | U5.5 R33.2 | C22.1 18.83,26.39 18.74,26.3 | 22.27,26.07 PWR.A 22.27,23.13 24.03,21.38 R22.2 | v18.17,63.5 J1.3
  Top 1.016: 21.35,26.75 21.35,26.52 22.17,25.7
  Bottom 0.813: v59.75,63.04 v59.75,56.11 v59.75,39.1 | v59.75,63.04 v64.19,58.6 | v59.75,63.04 54.8,68 v33.67,68 | v18.18,26.3 v18.17,26.31 18.17,36.4 v18.17,36.98 v18.17,63.5
  pour Top: 60.06,51.38 59.02,51.38 59.02,54.33 58.54,54.81 56,54.81 56,57.58 59.5,57.58 60.01,57.07 60.06,57.02
D+
  Top 0.254: USB-TTL.B6 10.7,37.25 10.33,37.62 10.33,38.23 10.58,38.48 11.3,38.48 11.53,38.25 USB-TTL.A6 19.88,38.26 21.43,39.8 IC1.3
D-  (via drill 0.3)
  Top 0.254: IC1.4 21.63,39.3 20.08,37.75 USB-TTL.A7 11.14,37.75 v11.02,37.87 | USB-TTL.B7 11.81,38.75 11.37,39.19 v11.02,39.19
  Bottom 0.254: v11.02,37.87 v11.02,39.19
DTR  (via drill 0.3)
  Top 0.254: 21.1,14.77 R26.2 19.04,14.76 Q3.2 18.25,14.77 17.75,15.27 v17.75,16.06 | IC1.23 24.02,42.57 v24.05,42.6
  Bottom 0.254: v24.05,42.6 21.05,42.6 19.65,41.2 19.65,17.97 v17.75,16.06
GAIN
  Top 0.254: IC2.P$2 63.03,44.47 R35.2 R34.1
GND  (via drill 0.3)
  Top 0.254: P5.4 51.86,24.48 52.09,24.26 54,24.26 P5.42 | P5.34 36.86,20.38 38.17,19.07 | C26.1 69.94,44.47 IC2.P$11 67.65,44.47 IC2.P$EP 67.15,43.97 IC2.P$3 | 66.57,46.86 67.15,46.27 IC2.P$15 67.15,44.56 v67.1,44.5 | 23.66,40.3 IC1.2 | IC1.2 22.76,40.3 22.75,40.31 | IC1.2 21.77,40.3 21.33,40.74
  other vias: 24.17,57.33 23.84,40.49 24.55,40.51 25.14,40.51 25.72,40.51 25.75,39.93 25.19,39.9 24.53,39.9 23.89,39.88 23.82,39.29 24.38,39.29 24.99,39.29 25.67,39.29 25.75,38.66 25.14,38.68 24.53,38.68 23.87,38.71 26.81,49.86 31.41,51.08 20.46,45.34 20.44,44.15 12.03,44.04 16.04,44.02 8.25,36.27 8.5,48.51 9.67,44.22 8.25,51.59 7.38,43.94 7.38,40.74 9.21,40.51 9.8,49.12 7.61,49.63 8.48,53.44 12.16,59.59 8.98,59.49 9.57,54.71 9.44,51.66 10.05,61.21 11.6,67.67 11.24,71.5 8.58,67.79 11.29,63.22 18.05,73.43 12.08,74.85 23.84,63.04 23.18,56.49 32.45,61.11 32.71,57.4 40.25,63.53 45.69,62.64 46.45,60.33 50.56,63.22 50.61,60.33 50.59,62.23 51,55.8 49.93,58.5 49.78,56.54 47.03,58.85 41.55,62.74 42.31,62.79 43.02,62.87 43.96,62.81 44.01,62 43.1,61.95 42.11,61.95 41.39,61.87 41.39,60.93 42.41,60.99 43.27,61.04 44.09,60.48 42.84,60.22 41.72,60.22 41.93,63.88 43.55,63.83 47.21,63.7 47.31,62.1 39.21,69.14 41.04,69.19 43.83,69.16 46.37,69.16 49.45,69.16 45.84,66.57 42,66.5 39.57,66.57 37.38,69.22 37.66,66.5 32.43,69.16 26.92,69.16 24.63,69.14 67.73,73.56 73.12,73.69 75.91,74.07 74.62,70.33 71.09,70.23 69.94,72.09 78.07,74.35 58.77,67.72 62.3,65.51 57.75,61.06 71.77,62.92 71.95,58.27 71.34,54.08 76.78,58.98 67.73,65.2 69.38,59.66 69.26,55.24 44.31,8.03 64.03,2.82 70.58,10.77 70.5,5.69 74.77,15.88 80.1,3.43 59.45,3.12 37.56,10.82 53.71,15.75 68.32,16.51 78.53,70.64 71.95,28.75 62.48,5.59 52.01,6.78 38.32,4.5 9.16,3.12 11.17,7.8 28.62,15.93 32.25,7.77 18.69,10.03 42.56,10.82 24.99,8.97 29.28,8.86 25.04,10.49 27.88,19.53 8.07,7.01 22.01,10.57 32.17,11.38 32.99,4.62 47.16,11.73 40.91,7.59 53.48,10.64 49.24,9.5 31.95,16.03 28.85,23.42 46.25,15.32 32.02,19.3 9.57,27.41 10.05,24.77 12.36,30.23 37.79,15.93 15.49,10.08 44.62,15.77 34.97,11.76 75.73,3.99 51.02,41.76 50.84,36.8 51,38.35 51.05,44.86 52.93,44.48 64.46,51.61 52.72,50.75 57.7,51.33 45.03,4.45 58.54,22.91 33.19,50.7 31.39,49.43 36.42,46.3 30.17,50.24 32.78,49.38 24.86,48.29 19.02,74.93 19.35,71.4 23.99,59.74 73.02,12.37 64.66,15.37 77.41,20.32 76.93,14.61 70.32,21.06 55.06,5.18 77.49,47.37 58.28,7.37 54.86,14.53 40.73,15.93 48.51,15.65 21.51,9.19 74.41,64.95 63.26,68.28 27.88,10.24 73.63,49.91 61.31,8.71 66.13,5.61 75.13,22.66 41.5,24.1 44.62,24.1 46.47,24 48.68,24.05 51.99,24.13 60.72,14.43 78.33,50.9 66.06,13.36 57.98,41.94 58.11,38.63 69.23,50.93 63.62,51.26 57.93,44.45 58.08,40.39 34.61,49.02 67.76,44.58 67.1,43.92 67.73,43.87 70.1,48.08 70.05,45.64 71.29,49.33 76.7,49.17 78.71,44.42 78.4,42.57 24.93,58.34 32.28,51.59 33.32,48.26 35.27,41.1 31.13,47.98 51.1,33.1 45.36,61.37 28.57,63.91 32.48,59.23 26.53,56.57 33.16,55.4 31.16,55.5 16.15,55.02 16.45,46.13 7.71,38.94 9.87,35.92 9.82,32.36 13.5,32.23 7.84,32.28 16.22,31.88 16.98,29.64 11.52,28.4 8.07,26.01 21.38,40.64 23.79,58.75 25.7,58.6 35.91,44.04 23.13,47.96 27.04,46.69 27.02,51.26 23.11,46.43 22.24,43.61 24.88,45.97 21.51,46.86 30.04,42.37 30.27,41.27 26.43,48.26 9.19,15.6 9.24,9.86 7.41,13.82 11.8,13.94 7.18,12.12 4.89,1.02 4.77,5.03 5.83,2.79 9.06,5.38 11.85,2.16 13.99,9.93 29.38,1.85 70.48,1.35 77.51,7.06 81.25,4.88 81.25,1.37 79.47,12.27 4.89,71.93 4.34,75.97 6.32,74.8 6.47,72.95 9.82,74.5 8.73,70.28 16.37,71.2 15.13,74.57 18.61,68.35 81.91,75.84 80.51,73.99 80.66,71.88 82.16,71.78 78.76,69.14 76.57,72.11 78.5,56.9 78.5,65.18 63.57,56.54 57.9,62.46 50.56,66.73 57.47,52.2 51.58,3.89 68.24,20.5 73.6,20.95 24.4,16.18 23.49,17.5 22.5,18.77 29.56,19.89 14.57,19.74 12.29,20.78 12.29,23.67 12.01,26.64 11.47,18.54 35.48,30.63 34.1,30.56 27.98,22.73 36.9,30.58 28.85,20.75 36.16,8 75.99,38.89 78.5,37.67 79.09,35.03 77.61,28.09 74.19,29.24 70.63,35.64 59.73,29.39 59.73,30 59.73,30.63 59.73,31.24 60.29,29.39 60.85,29.39 61.41,29.39 61.94,29.39 62.5,29.36 60.29,31.24 60.82,31.24 60.85,30.63 61.43,30.63 61.36,31.24 61.94,30.66 61.94,31.27 62.53,30.61 62.5,31.24 75.02,36.75 78.88,32.36 75.25,40.08 75.68,28.09 73.52,38.51 76.5,36.86 77.56,34.37 64.43,47.27 65.98,47.93 58.26,29.62 59.71,21.69 8.58,23.47 30.32,16.08 60.32,29.97 60.88,29.97 61.43,29.97 61.99,29.97 62.53,29.97 60.32,30.63 35.53,47.5 16.58,35.97 21.66,31.57 21.89,29.34 23.08,31.7 26.87,30.48 28.82,29.29 31.72,37.41 62.88,37.52 62.68,35.18 70.02,42.21 20.95,35.81 21,34.92 23.87,44.3 62.09,24.54 61.41,22.58 57.85,20.5 57.78,28.35 57.75,26.24 63.9,19.76 69.44,23.16 78.91,23.14 61.1,23.62
  pour Top (isolate 0.254, rank 6): -4.14,85 -4.14,-5 90.86,-5 90.86,85
  pour Bottom (isolate 0.254, rank 6): -5.14,-5 90.86,-5 90.86,85 -5.14,85
I2S_BCLK
  Top 0.254: IC2.P$16 63.59,45.62 R41.2
I2S_DIN
  Top 0.254: IC2.P$1 62.79,44.97 R38.2
I2S_LRCLK
  Top 0.254: IC2.P$14 R42.2
IO0  (via drill 0.3)
  Top 0.254: v42.87,29.97 v42.86,29.96 P5.22 42.86,15.26 v42.84,14.95 | U1.27 51.78,52.76 49.65,54.89 v42.74,54.89 | FLASH.2 R44.1 15.83,12.65 Q3.3 16.58,14.24 v16.58,14.95 | R22.1 v25.91,15.07 v25.9,15.06
  Bottom 0.254: v42.87,29.97 42.87,54.76 v42.74,54.89 | v16.58,14.95 25.9,14.95 | 25.9,14.95 v42.84,14.95 | v25.9,15.06 25.9,14.95
IO1/CS  (via drill 0.3)
  Top 0.254: U1.39 49.88,68 48.46,66.57 v48.46,62.87 | P5.11 48.36,27.72 v48.46,27.81
  Bottom 0.254: v48.46,27.81 v48.46,62.87
IO2  (via drill 0.3)
  Top 0.254: P5.33 37.36,22.53 39.57,20.32 v40.33,20.32 | U1.38 v54.14,66.73
  Bottom 0.254: v54.14,66.73 56.61,64.26 56.61,22.81 54.12,20.32 v40.33,20.32
IO3  (via drill 0.3)
  Top 0.254: U1.15 37.18,52.63 37.66,53.11 v40.23,53.11 | P5.27 40.36,27.12 v40.25,27.23
  Bottom 0.254: v40.25,27.23 40.12,27.36 40.12,53.01 v40.23,53.11
IO4/VSYNC  (via drill 0.3)
  Top 0.254: P5.14 46.86,27.2 v46.75,27.3 | U1.4 35.54,65.33 36.03,65.33 39.97,61.39 v39.97,59.26
  Bottom 0.254: v46.75,27.3 46.63,27.43 46.63,57.02 44.39,59.26 v39.97,59.26
IO5/HSYNC  (via drill 0.3)
  Top 0.254: U1.5 35.64,63.96 36.11,63.96 39.29,60.78 39.29,58.93 v39.57,58.65 | P5.15 46.36,26.63 v46.25,26.75
  Bottom 0.254: v46.25,26.75 46.12,26.87 46.12,56.72 44.19,58.65 v39.57,58.65
IO6  (via drill 0.3)
  Top 0.254: P5.17 45.36,27.08 v45.48,27.2 | v40.1,58.04 39.06,58.04 38.7,58.4 38.7,60.22 36.01,62.92 U1.6
  Bottom 0.254: v45.48,27.2 45.59,27.3 45.59,56.39 43.93,58.04 v40.1,58.04
IO7  (via drill 0.3)
  Top 0.254: P5.18 44.86,27.67 v44.98,27.79 | v40.81,57.43 38.52,57.43 38.14,57.81 38.14,59.49 36.01,61.62 35.44,61.62 U1.7
  Bottom 0.254: v44.98,27.79 45.08,27.89 45.08,56.08 43.73,57.43 v40.81,57.43
IO8  (via drill 0.3)
  Top 0.254: U1.12 35.61,55.5 v40.17,55.5 | P5.21 43.36,29.42 v43.45,29.52
  Bottom 0.254: v43.45,29.52 43.45,55.24 43.2,55.5 v40.17,55.5
IO9  (via drill 0.3)
  Top 0.254: P5.23 42.36,29.44 v42.26,29.54 | v42.26,47.8 39.72,50.34 U1.17
  Bottom 0.254: v42.26,29.54 v42.26,47.8
IO10/CS  (via drill 0.3)
  Top 0.254: SD.2 61.58,60.8 R8.1 61.35,60.43 v61.35,59.38 D4.1 | U1.18 40.99,50.75 43.98,47.75 59.17,47.75 59.76,48.34 61.29,48.34 v61.35,48.4
  Bottom 0.254: v61.35,48.4 v61.35,59.38
IO11/MOSI  (via drill 0.3)
  Top 0.254: P5.9 49.36,26.61 v49.47,26.72 | 49.75,48.36 58.76,48.36 v58.86,48.46 | v49.75,48.46 49.75,48.36 | SD.3 65.62,59.72 63.54,59.72 61.84,58.01 60.16,58.01 59.85,58.33 D4.3 v58.86,58.67 R4.1 | 49.75,48.36 44.42,48.36 42.26,50.52 U1.19
  Bottom 0.254: v49.47,26.72 49.57,26.82 49.57,48.28 v49.75,48.46 | v58.86,48.46 v58.86,58.67
IO12/SCLK  (via drill 0.3)
  Top 0.254: R5.1 60.6,55.72 60.6,56.11 | SD.5 60.77,57.51 60.6,57.33 D4.5 60.6,56.11 | U1.20 43.53,50.16 44.62,49.07 49.09,49.07 | P5.10 48.86,27.18 v48.96,27.28 | 49.09,49.07 60.6,49.07 v60.7,48.97 | v49.06,48.97 49.06,49.05 49.09,49.07 | v60.7,56.13 60.67,56.11 60.6,56.11
  Bottom 0.254: v48.96,27.28 49.06,27.38 v49.06,48.97 | v60.7,56.13 v60.7,48.97
IO13/MISO  (via drill 0.3)
  Top 0.254: 61.76,53.7 v62.07,53.7 62.07,54 | 61.76,53.7 61.16,53.7 R6.1 | U1.21 44.8,50.57 45.79,49.58 v62.07,49.58 | D4.6 62.07,56.16 62.07,55.68 | 62.07,55.68 62.07,55.3 | 62.07,55.3 62.07,54.97 | 62.07,54.97 62.07,54.1 62.07,54 | SD.7 62.08,55.3 62.07,55.3 | 62.07,55.68 62.43,55.32 62.07,54.97 | 62.07,54 61.76,53.7
  Bottom 0.254: v62.07,49.58 v62.07,53.7
IO14  (via drill 0.3)
  Top 0.254: P5.24 41.86,28.82 v41.75,28.93 | v42.05,52.96 45.76,52.96 46.07,52.65 U1.22
  Bottom 0.254: v41.75,28.93 41.65,29.03 41.65,51.92 42.05,52.32 v42.05,52.96
IO15  (via drill 0.3)
  Top 0.254: U1.8 36.08,60.38 37.63,58.83 37.63,57.51 38.32,56.82 v40.1,56.82 | P5.19 44.36,28.24 v44.47,28.35
  Bottom 0.254: v44.47,28.35 44.57,28.45 44.57,55.78 43.53,56.82 v40.1,56.82
IO16  (via drill 0.3)
  Top 0.254: U1.9 35.44,59.13 36.44,59.13 37.13,58.45 37.13,57.23 38.14,56.21 v40.78,56.21 | P5.20 43.86,28.88 v43.96,28.98
  Bottom 0.254: v43.96,28.98 44.06,29.08 44.06,55.52 43.38,56.21 v40.78,56.21
IO17/I2C_SDA  (via drill 0.3)
  Top 0.254: U1.10 v36.52,57.84 | v39.46,27 36.36,27 35.86,26.5 P5.36 35.86,17.68 35.4,17.22 v35.2,17.22 | J2.2 15.82,24.66 20.39,24.66 20.54,24.82 R33.1 20.9,24.54 v20.9,23.9
  Bottom 0.254: v36.52,57.84 39.62,54.74 39.62,27.15 v39.46,27 | v20.9,23.9 20.9,22 25.67,17.22 v35.2,17.22
IO18/I2C_SCL  (via drill 0.3)
  Top 0.254: U1.11 | U1.11 35.44,56.59 v36.62,56.59 | v38.96,27.64 36.24,27.64 35.36,26.76 P5.37 35.36,18.15 v35.17,17.96 | U1.11 30.24,56.57 26.81,59.99 R27.1 | J2.1 20.21,22.3 v21.61,22.3
  Bottom 0.254: v36.62,56.59 39.11,54.1 39.11,27.79 v38.96,27.64 | v35.17,17.96 25.95,17.96 v21.61,22.3
IO19  (via drill 0.3)
  Top 0.254: U1.13 v32.02,54.03 25.7,54.03 22.75,51.08 v20.41,51.08 R20.2 | J1.1 v20.4,59.5 v20.41,59.51 | R38.1 60.16,46.08 39.95,46.08 v37.81,48.21
  Bottom 0.254: v20.41,59.51 v20.41,51.08 | v37.81,48.21 32.02,54 v32.02,54.03
IO20  (via drill 0.3)
  Top 0.254: U1.14 v34.1,52.76 26.46,52.76 23.26,49.55 v21.33,49.55 R21.2 | J1.2 v21.32,61.5 v21.33,61.49 | R41.1 60.7,46.63 40.25,46.63 v37.63,49.25
  Bottom 0.254: v21.33,61.49 v21.33,49.55 | v37.63,49.25 34.13,52.76 v34.1,52.76
IO21  (via drill 0.3)
  Top 0.254: v47.34,52.76 U1.23 | FB1.1 v47.85,33
  Bottom 0.254: v47.85,33 47.85,52.25 v47.34,52.76
IO38  (via drill 0.3)
  Top 0.254: R45.1 v38.02,28.47 | v38.07,54.05 39.72,54.05 43.5,57.84 U1.31
  Bottom 0.254: v38.02,28.47 38.55,29.01 38.55,53.57 v38.07,54.05
IO39  (via drill 0.3)
  Top 0.254: P5.29 39.36,24.23 v40.35,23.24 | U1.32 v54.02,59.11
  Bottom 0.254: v54.02,59.11 54.58,58.55 54.58,24.49 53.33,23.24 v40.35,23.24
IO40  (via drill 0.3)
  Top 0.254: P5.30 38.86,23.54 39.87,22.53 v40.35,22.53 | U1.33 v54.07,60.38
  Bottom 0.254: v54.07,60.38 55.08,59.36 55.08,24.13 53.48,22.53 v40.35,22.53
IO41  (via drill 0.3)
  Top 0.254: P5.31 38.36,23.15 39.72,21.79 v40.35,21.79 | U1.34 52.94,61.67 v54.09,61.67
  Bottom 0.254: v54.09,61.67 55.59,60.17 55.59,23.77 53.61,21.79 v40.35,21.79
IO42  (via drill 0.3)
  Top 0.254: P5.32 37.86,22.81 39.62,21.06 v40.33,21.06 | U1.35 v54.12,62.92
  Bottom 0.254: v54.12,62.92 56.1,60.94 56.1,23.27 53.89,21.06 v40.33,21.06
IO45/DE  (via drill 0.3)
  Top 0.254: P5.13 47.36,27.71 v47.24,27.84 | v47.24,50.19 50.87,50.19 51.15,50.47 U1.26
  Bottom 0.254: v47.24,27.84 v47.24,50.19
IO46
  Top 0.254: U1.16 38.45,50.6 41.9,47.14 59.45,47.14 60.06,47.75 62.53,47.75 64,49.23 R42.1
IO47  (via drill 0.3)
  Top 0.254: P5.25 41.36,28.23 v41.24,28.35 | U1.24 48.61,53.01 47.95,53.67 v41.52,53.67
  Bottom 0.254: v41.24,28.35 41.14,28.45 41.14,52.2 41.42,52.48 41.42,53.57 v41.52,53.67
IO48  (via drill 0.3)
  Top 0.254: P5.26 40.86,27.71 v40.73,27.84 | U1.25 49.88,53.44 49.04,54.28 v40.91,54.28
  Bottom 0.254: v40.73,27.84 40.63,27.94 40.63,52.5 40.91,52.78 v40.91,54.28
LCD_RST  (via drill 0.3)
  Top 0.254: C14.2 R2.1 50.86,27.87 P5.6 50.86,13.96 v50.84,13.68 | R46.2 v15.03,13.68
  Bottom 0.254: v15.03,13.68 v50.84,13.68
LED+  (via drill 0.3)
  Top 0.254: P5.1 v53.36,26.87 | v53.36,40.39 C12.2 C11.2 D1.- 38.28,40.39 v37.89,40.01 | U2.5 v33.11,40.01
  Bottom 0.254: v53.36,26.87 v53.36,40.39 | v33.11,40.01 v37.89,40.01
LED-  (via drill 0.3)
  Top 0.254: v52.57,26.77 52.36,26.56 P5.3 P5.2
  Top 0.406: U2.3 36.6,42.27 R3.2 R32.2 v52.57,42.8
  Bottom 0.254: v52.57,26.77 v52.57,42.8
N$1
  Top 0.254: IC1.16 C4.2
N$2
  Top 0.254: Q4.1 21.1,16.29 R26.1
N$3
  Top 0.254: Q3.1 21.9,12.87 22.6,13.56 R25.1
N$4
  Top 0.254: IC2.P$9 71.33,43.47 R18.1
  pour Top: 70.27,43.46 71.11,42.62 71.9,42.62 72.03,42.75 72.03,43.36 71.92,43.46
N$6
  Top 0.254: USB-NATIVE.A5 16.04,51.25 R15.2
N$7
  Top 0.61: PWR.C R19.2
N$8
  Top 0.61: R28.1 R51.2 31.17,46.31 Q2.1
N$10
  Top 0.254: USB-TTL.A5 R13.2
N$11
  Top 0.254: USB-TTL.B5 14.58,36.25 R12.2
N$12  (1 unrouted)
  Top 0.254: IC1.7 23.52,35.07 R10.1 | 24.58,35.08 23.54,36.12 23.54,35.79 24.07,35.26
  Top 0.813: R10.1 R11.1
N$13
  Top 0.254: IC2.P$10 71.01,43.97 R39.1
  pour Top: 70.4,43.97 71.54,45.11 71.92,45.11 72,45.03 72,44.04 71.92,43.97
N$14
  Top 0.254: USB-NATIVE.B5 17.2,48.25 R14.2
N$15
  Top 0.254: 73.41,43.24 R18.2
  Top 0.813: C25.2 R18.2 73.25,43.24 SPK.1
N$16
  Top 0.254: 73.38,44.49 R39.2
  Top 0.813: C26.2 R39.2 73.22,44.49 SPK.2
N$17
  Top 0.254: U2.1 37.71,38.28 37.71,37.92 | 37.71,37.92 37.71,35.46 | 37.71,35.46 L1.P$2 | R23.2 37.83,35.33 37.71,35.46 | D1.+ 37.78,37.99 37.71,37.92
  pour Top: 36.29,39.32 36.29,32.79 38.47,32.79 38.47,34.29 39.01,34.82 40.43,34.82 40.43,38.56 38.3,38.56 37.53,39.32
N$18
  Top 0.254: IC1.21 25.02,43.75 R29.2
N$19
  Top 0.254: IC1.20 25.52,42.63 R30.2
N$22
  Top 0.254: R23.1 C2.2
N$23
  Top 0.406: U6.2 R48.1
N$24
  Top 0.61: R36.1 32.04,40.95 U2.4 34,41.8 34.74,42.55 R31.2 34.71,42.9 Q2.3
N$29
  Top 0.406: U6.7 R49.2
N$30
  Top 0.406: U6.6 61.76,35.92 R50.2
N$31
  Top 0.406: D8.C R49.1
N$32
  Top 0.406: D9.C R50.1
N$47
  Top 0.254: SD.1 61.4,61.91 R7.1
N$48
  Top 0.254: SD.8 64.31,54.2 62.15,52.05 R9.1
N$76
  Top 0.406: U5.4 19.12,30.29 19.12,30.41 C30.1
PCLK
  Top 0.254: P5.12 C27.2 47.87,30.23 FB1.2
RESET  (via drill 0.3)
  Top 0.254: U1.3 33.62,66.73 32.99,66.09 R16.1 C8.1 v28.86,66.09 | RST.2 12.7,17.24 13.2,17.24 | 13.2,17.24 15.01,17.24 | 15.01,17.24 Q4.3 v17.01,18.16 | R24.1 13.2,17.24 | R46.1 15.01,17.24
  Bottom 0.254: v28.86,66.09 22.29,66.09 19.09,62.89 19.09,20.24 v17.01,18.16
RTS  (via drill 0.3)
  Top 0.254: Q4.2 v20.42,18.19 | R25.2 22.6,17.04 21.45,18.19 v20.42,18.19 | IC1.19 26.02,41.88 v26.36,42.22 | v20.42,18.19 v20.41,18.19
  Bottom 0.254: v26.36,42.22 26.1,41.96 21.33,41.96 20.24,40.87 20.24,18.36 v20.41,18.19
RXD/IO44  (via drill 0.3)
  Top 0.254: U1.36 50.97,64.19 v50.46,64.69 | R29.1 v28.64,44.82 29.59,44.82 R28.2
  Bottom 0.254: v50.46,64.69 33.7,64.69 28.64,59.64 v28.64,44.82
TP_INT  (via drill 0.3)
  Top 0.254: P5.35 v36.36,12.63 v36.36,12.62 | v8.83,12.62 9.62,12.62 R44.2
  Bottom 0.254: v36.36,12.62 v8.83,12.62
TP_RST  (via drill 0.3)
  Top 0.254: R24.2 v13.23,14.3 | R45.2 C18.2 R17.1 P5.38 34.86,19.09 34.38,18.62 v34.38,14.3
  Bottom 0.254: v13.23,14.3 v34.38,14.3
TXD/IO43  (via drill 0.3)
  Top 0.254: U1.37 52.83,65.38 v51.07,65.38 | R30.1 v28.64,43.22
  Bottom 0.254: v51.07,65.38 51.05,65.35 33.37,65.35 27.91,59.89 27.91,43.95 v28.64,43.22
USB_D+
  Top 0.254: USB-NATIVE.A6 13.94,50.25 | 13.94,50.25 16.67,50.25 R21.1 | USB-NATIVE.B6 13.73,49.25 13.94,49.45 13.94,49.89 | 13.94,49.89 13.94,49.94 | 13.94,49.94 13.94,50.25 | 13.94,49.94 13.63,50.24 14.29,50.24 13.94,49.89
USB_D-
  Top 0.254: R20.1 17.04,50.75 USB-NATIVE.B7 11.47,50.75 11.27,50.55 11.27,49.94 11.46,49.75 USB-NATIVE.A7
VBAT
  pour Top: 73.96,31.95 67.89,31.95 66.51,30.58 65.75,30.58 64.46,31.88 63.75,32.59 62.76,32.59 62.76,34.09 63.75,34.09 64.76,33.07 73.96,33.07
VBUS  (via drill 0.3)
  Top 0.254: IC1.8 24.02,36.93 24.63,36.32 | C36.1 14.9,35
  Top 0.61: USB-TTL.VBUS2 v13.66,35.55 14.35,35.55 14.9,35 16.02,33.88 26.48,33.88 | USB-TTL.VBUS1 v13.66,40.45 14.74,40.45 C7.2 | 26.48,33.88 28.9,33.88 | 28.9,33.88 D5.A | 26.48,33.88 27.27,34.67 R11.2 27.27,35.36 28.24,36.32 | C6.2 C35.2 28.24,36.32 | 28.24,36.32 27.6,36.32 | 26.61,36.32 24.63,36.32 | 28.9,33.88 30.75,33.88 30.75,36.78 28.06,36.78 27.6,36.32 | 27.6,36.32 26.61,36.32 | 26.61,36.32 27.12,35.81 27.12,34.39 28.62,34.39 28.62,34.85 27.45,34.85 27.45,35.97 27.53,36.04 30.52,36.04 30.07,35.59 27.81,35.59 27.81,35.26 28.72,35.26
  Bottom 0.61: v13.66,40.45 v13.66,35.55 v13.66,35.56
VDD
  Top 0.254: IC2.P$7 IC2.P$8 68.15,40.68 C24.2 | C24.2 C23.2 | C23.2 C19.2 | C23.2 R40.1 | R34.2 R43.2 68.01,40.82 C24.2
  pour Top: 68.7,36.98 66.21,36.98 66.21,39.65 65.73,40.13 61.82,40.13 61.82,41.22 67.02,41.22 67.56,41.76 67.56,43.08 68.7,43.08
VPWR  (via drill 0.3)  (2 unrouted)
  Top 0.254: 22.94,30.4 23.77,30.4 24.38,29.79 24.38,28.98 24,28.6 23.35,28.6 U5.1
  Top 0.406: U5.1
  Top 0.61: L1.P$1 34.01,37.46 33.33,38.14 | R36.2 33.33,38.14 | U2.6 33.33,38.39 33.33,38.14 | Q1.2 67.51,28.84 | 67.51,28.84 68.84,28.84 C13.2 | 67.51,28.84 | R37.2 C16.1 65.1,34.6 D11.- | 24.55,29.29 25.62,28.22
  Top 0.813: v64,35.89 C16.1 | v64,35.89 65.09,34.8 | 65.09,34.8 65.09,34.49 | 65.09,34.8 65.09,36.98 | 65.09,37.52 65.09,36.98 | 65.09,36.98 v64,35.89 | L1.P$1 v32.76,34.9 | v28.8,28.17 C15.2 C17.2 24.4,28.17 | 24.4,28.17 22.94,28.17 | 24.4,28.17 24.55,28.32 24.55,29.29 D2.- 22.94,30.4
  Bottom 0.61: 32.02,29.36 30.85,28.19 31.95,27.1
  Bottom 0.813: v64,35.89 68.75,31.14 v68.75,27.81 60.22,19.28 39.08,19.28 31.97,26.39 31.97,28.19 | 31.97,28.19 31.97,34.11 v32.76,34.9 | v28.8,28.17 31.95,28.17 31.97,28.19
  pour Top: 66.62,29.34 69.36,29.34 69.36,26.9 66.67,26.9 66.62,26.9
  pour Top: 34.61,39.34 34.61,32.92 32.38,32.92 32.38,39.34

### Text on the board
tPlace: GND | +3V3 | IO20 | IO19 | - | + | + | - | GND | +3V3 | IO17 | SDA | IO18 | SCL | ESP32-S3 Parallel | TFT with Touch | 4.0" ST7701 v1.2 | www.makerfabs.com